# EasyEDA schematic RC LOW PASS FILTER.json
TITLE: Sheet_1; REV: 1.0; Date: 2024-02-26; Sheet: 1/1; Drawn By: as7764; Company: Your Company
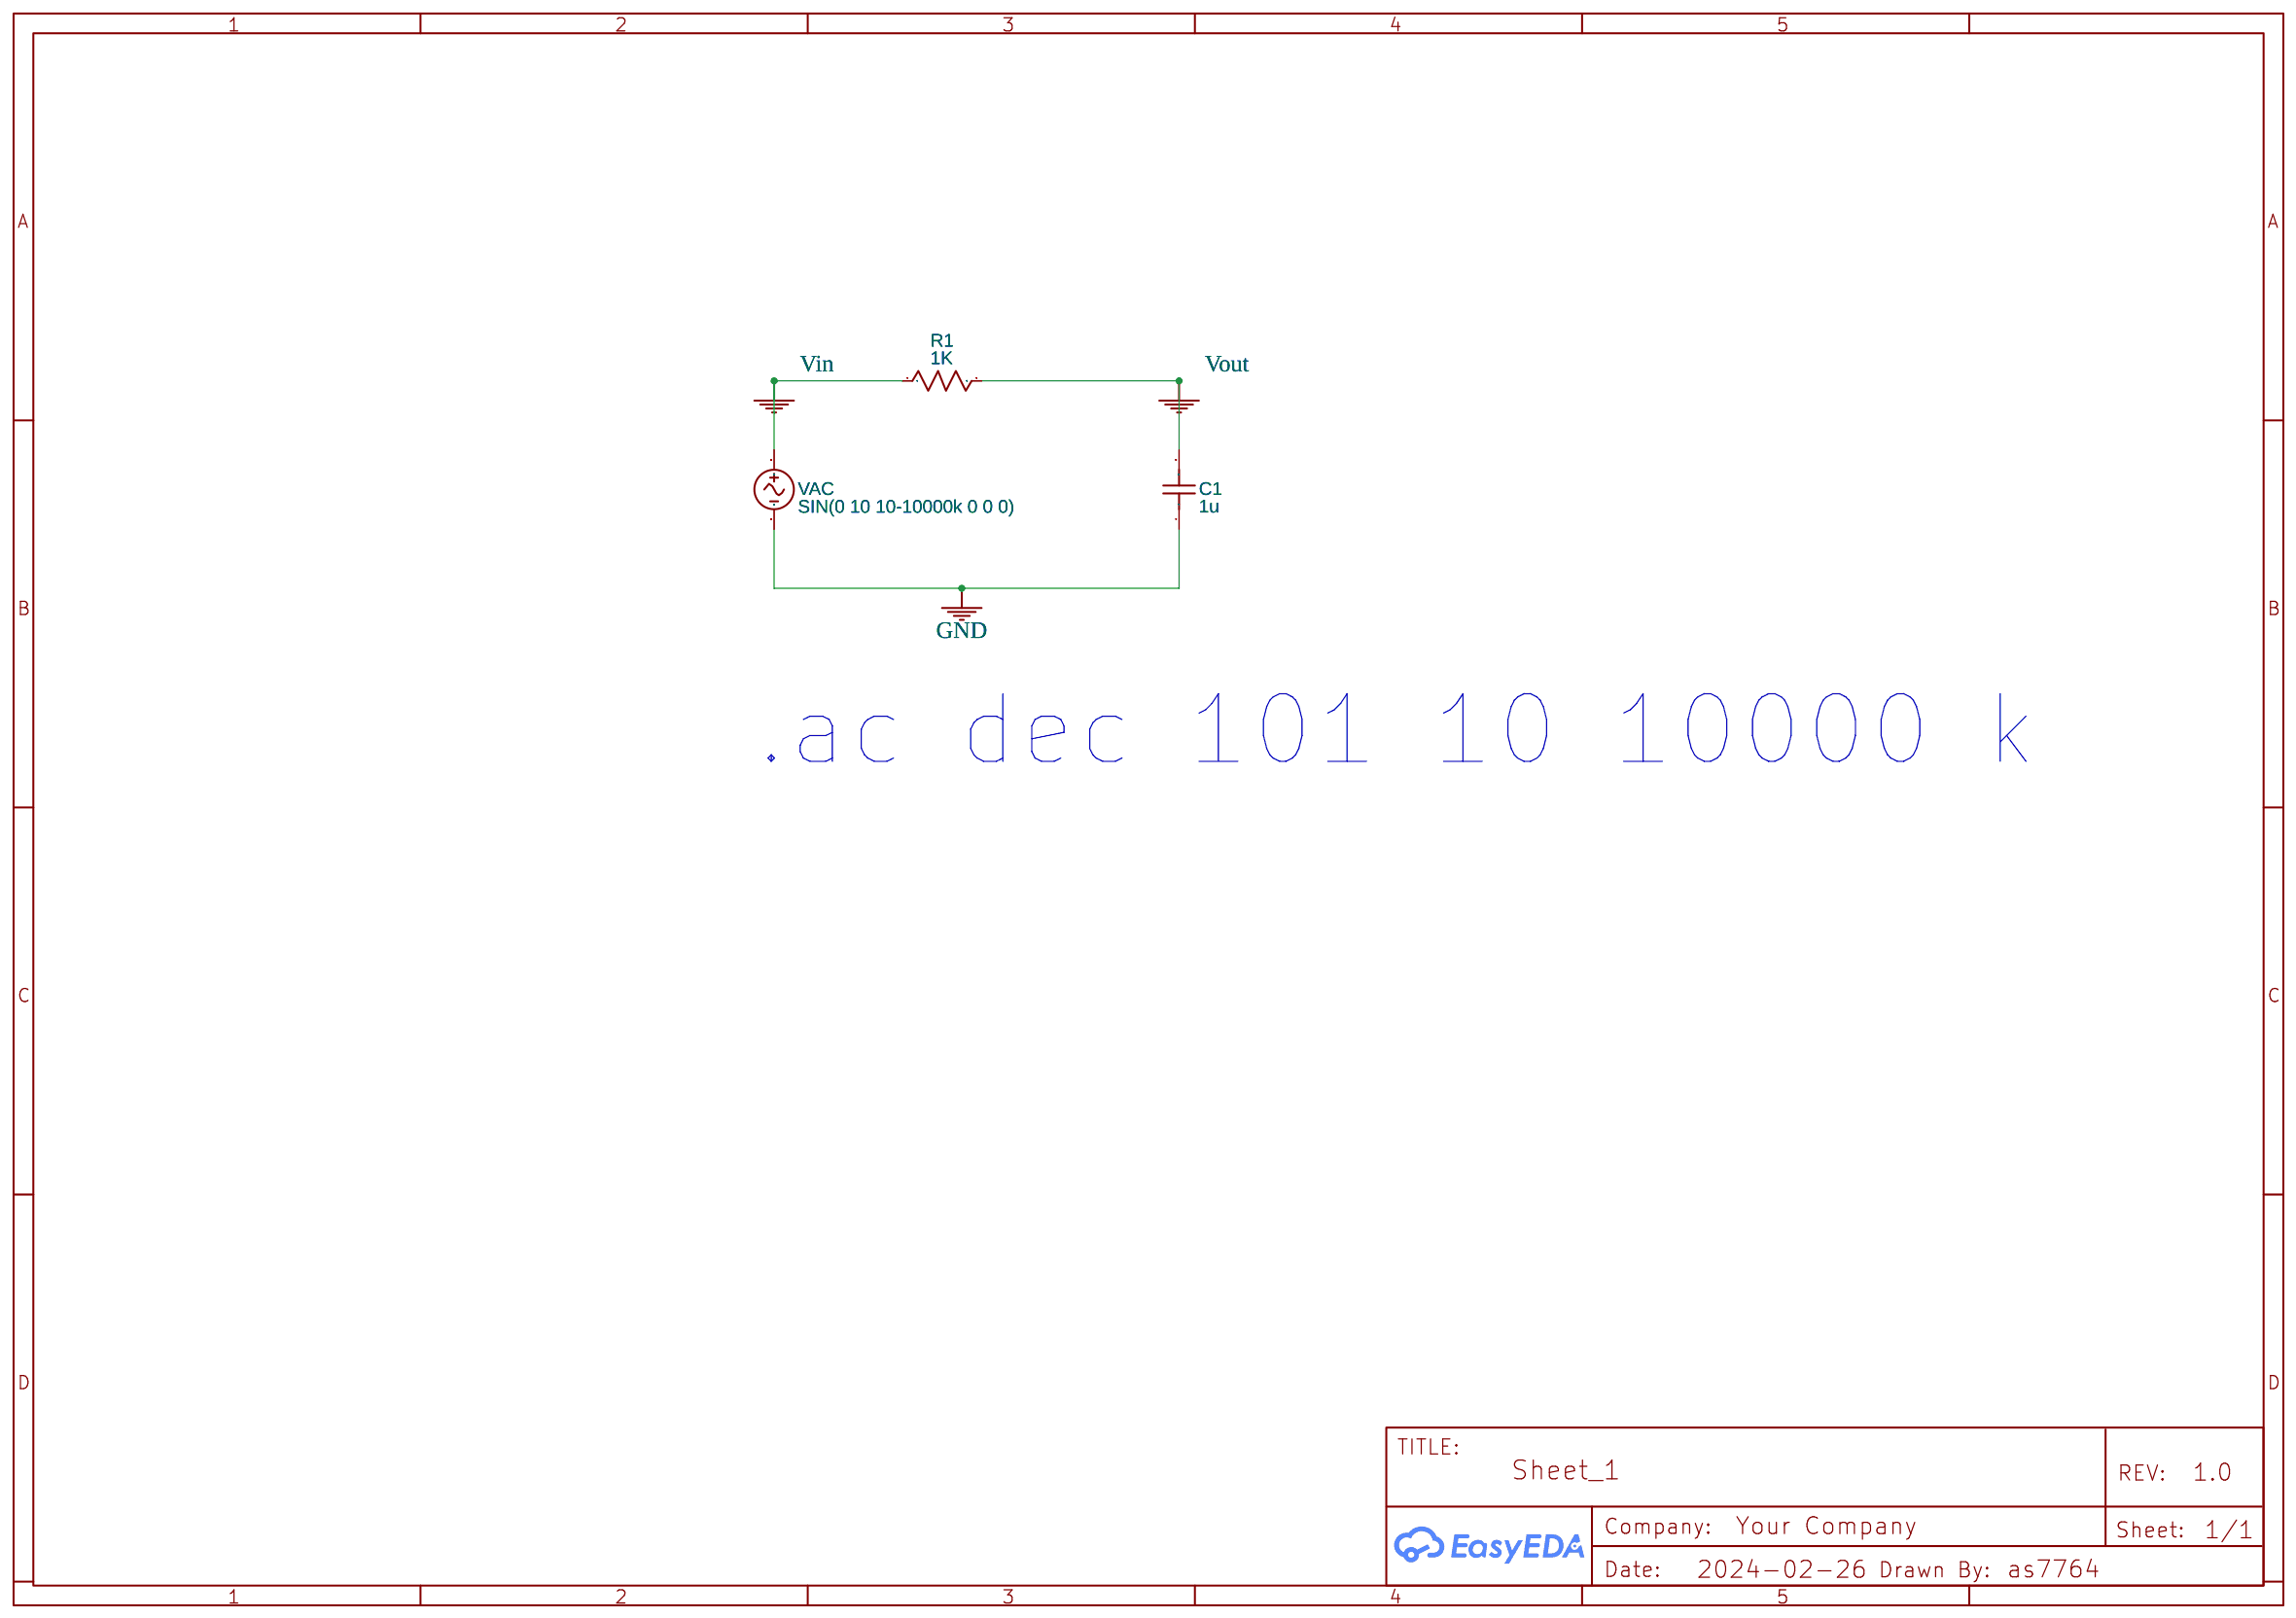
[diagram p0: schematic sheet]

## Parts
C1  1u  [RAD-0.1]
R1  1K  [AXIAL-0.3]
VAC  SIN(0 10 10-10000k 0 0 0)  [HDR1X2]

## Library data of the parts
C1 = Capacitor_US: Contributor: EasyEDA; Supplier: YUJING
R1 = Resistor_US: Resistance: 1k; Contributor: EasyEDA; Supplier: YUJING
VAC = VSin: Contributor: EasyEDA; sim: true; AC_Amplitude: 10

## Nets
GND: C1.1 VAC.2
Vin: R1.1 VAC.1
Vout: C1.2 R1.2

## Notes on the sheet
- .ac dec 101 10 10000 k
